# EAGLE design rtu04_half bridge (EAGLE 9.6.0)
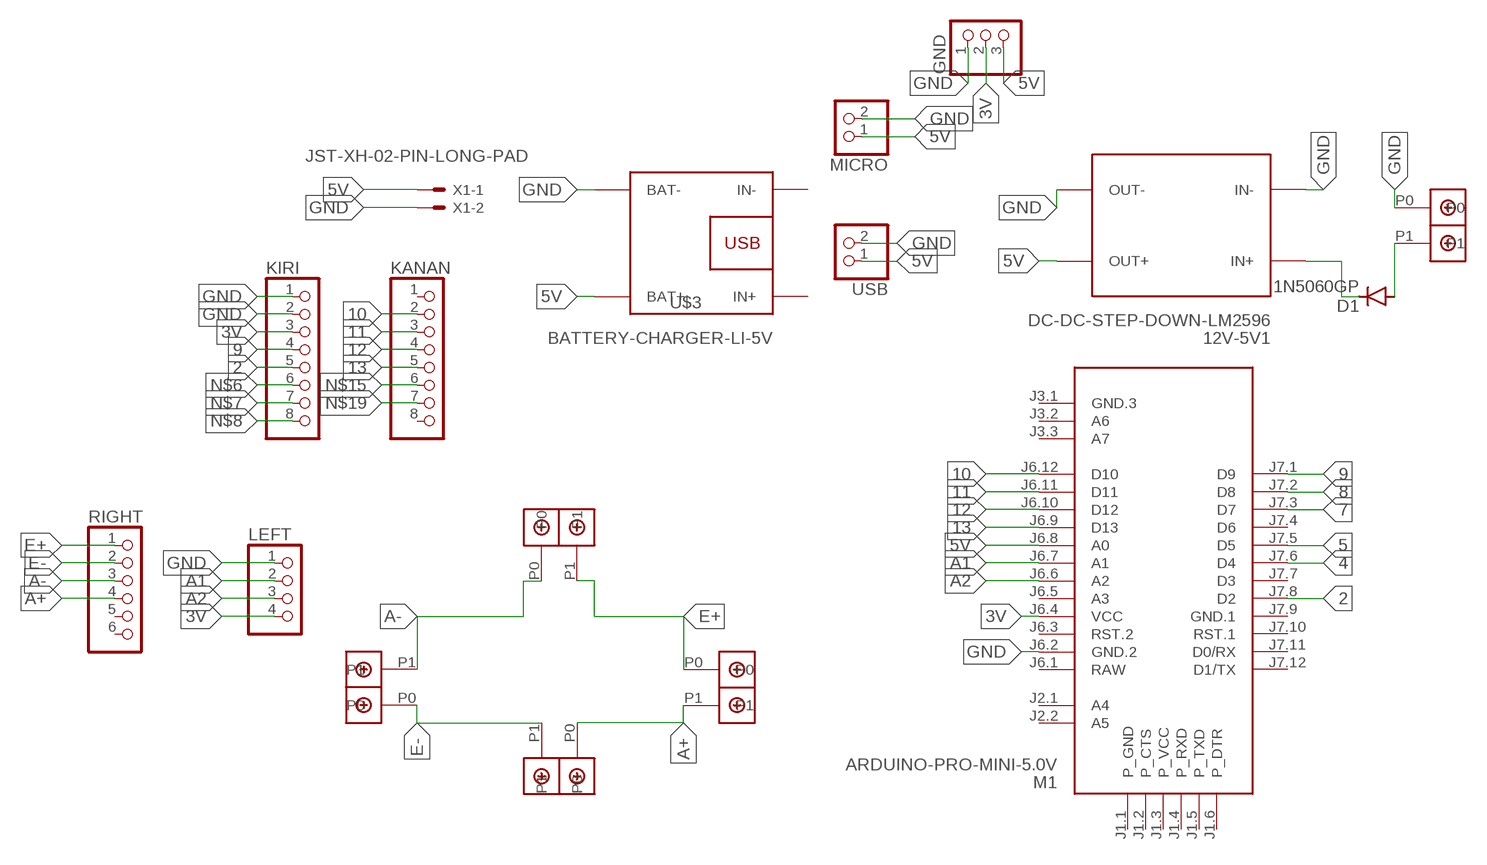
[diagram p0: schematic, sheet 1]

## Parts
12V-5V1  DC-DC-STEP-DOWN-LM2596  [DC-DC-STEP-DOWN-LM2596]
D1  1N5060GP  [DO15-12]
GND  PINHD-1X3  [1X03]
KANAN  PINHD-1X8  [1X08]
KIRI  PINHD-1X8  [1X08]
LEFT  PINHD-1X4  [1X04]
M1  ARDUINO-PRO-MINI-5.0V  [ARDUINO-PRO-MINI]
MICRO  PINHD-1X2  [1X02]
RIGHT  PINHD-1X6  [1X06]
U$1  DBCONN-1X2  [DBCONN-1X2]
U$2  DBCONN-1X2  [DBCONN-1X2]
U$3  BATTERY-CHARGER-LI-5V  [BATTERY-CHARGER-LI-5V]
U$4  DBCONN-1X2  [DBCONN-1X2]
U$5  DBCONN-1X2  [DBCONN-1X2]
U$6  DBCONN-1X2  [DBCONN-1X2]
USB  PINHD-1X2  [1X02]
X1  JST-XH-02-PIN-LONG-PAD  [JST-XH-02-PACKAGE-LONG-PAD]

## Nets
2: KIRI.5 M1.J7.8(D2)
3V: GND.2 KIRI.3 LEFT.4 M1.J6.4(VCC)
4: M1.J7.6(D4)
5: M1.J7.5(D5)
5V: 12V-5V1.OUT+ GND.3 M1.J6.8(A0) MICRO.1 U$3.BAT+ USB.1 X1.1
7: M1.J7.3(D7)
8: M1.J7.2(D8)
9: KIRI.4 M1.J7.1(D9)
10: KANAN.2 M1.J6.12(D10)
11: KANAN.3 M1.J6.11(D11)
12: KANAN.4 M1.J6.10(D12)
13: KANAN.5 M1.J6.9(D13)
A1: LEFT.2 M1.J6.7(A1)
A2: LEFT.3 M1.J6.6(A2)
A+: RIGHT.4 U$2.P0 U$4.P1
A-: RIGHT.3 U$5.P0 U$6.P1
E+: RIGHT.1 U$4.P0 U$5.P1
E-: RIGHT.2 U$2.P1 U$6.P0
GND: 12V-5V1.IN- 12V-5V1.OUT- GND.1 KIRI.1 KIRI.2 LEFT.1 M1.J6.2(GND.2) MICRO.2 U$1.P0 U$3.BAT- USB.2 X1.2
N$1: 12V-5V1.IN+ D1.C
N$2: D1.A U$1.P1
N$6: KIRI.6
N$7: KIRI.7
N$8: KIRI.8
N$15: KANAN.6
N$19: KANAN.7
Unconnected: KANAN.1 KANAN.8 M1.J1.1(P_GND) M1.J1.2(P_CTS) M1.J1.3(P_VCC) M1.J1.4(P_RXD) M1.J1.5(P_TXD) M1.J1.6(P_DTR) M1.J2.1(A4) M1.J2.2(A5) M1.J3.1(GND.3) M1.J3.2(A6) M1.J3.3(A7) M1.J6.3(RST.2) M1.J6.5(A3) M1.J7.4(D6) M1.J7.7(D3) M1.J7.10(RST.1) M1.J7.11(D0/RX) M1.J7.12(D1/TX) RIGHT.5 RIGHT.6 U$3.IN+ U$3.IN-

## Power pins joined to a net without a drawn wire
GND.1: M1.J7.9(GND.1)
RAW: M1.J6.1(RAW)

## Library data of the parts
12V-5V1 = diy-modules:DC-DC-STEP-DOWN-LM2596: DC/DC Step-Down Regulator based on LM2596-ADJ chip LM2596 datasheet available here: http://www.ti.com/lit/ds/symlink/lm2596.pdf Click here to find device on ebay.com <http://www.ebay.com/sch/lm2596+power+regulator>
D1 = diode:1N5060GP: DIODE controlled avalanche rectifier
GND = pinhead:PINHD-1X3: PIN HEADER
KANAN KIRI = pinhead:PINHD-1X8: PIN HEADER
LEFT = pinhead:PINHD-1X4: PIN HEADER
M1 = diy-modules:ARDUINO-PRO-MINI-*: Arduino Pro Mini and compatible devices More details available here: https://www.arduino.cc/en/Main/ArduinoBoardProMini Click here to find device on ebay.com <http://www.ebay.com/sch/arduino+pro+mini>
MICRO USB = pinhead:PINHD-1X2: PIN HEADER
RIGHT = pinhead:PINHD-1X6: PIN HEADER
U$1 U$2 U$4-U$6 = Terminal Block Connector:DBCONN-1X2
U$3 = diy-modules (1):BATTERY-CHARGER-LI-5V: Lithium Battery 5V Charger More details available here: http://www.buildcircuit.com/how-to-use-micro-usb-5v-1a-lithium-battery-charging-board-charger-module/ Click here to find device on ebay.com <http://www.ebay.com/sch/tp4056+charger+usb>
X1 = Rembrandt Electronics - JST XH Connectors v1-0:JST-XH-02-PIN: JST XH Connector 2 Pin Wire to board connector. Pitch: 2,54 mm, (0.100") Number of pins: 2 Created by Rembrandt Electronics www.rembrandtelectronics.com

## Board
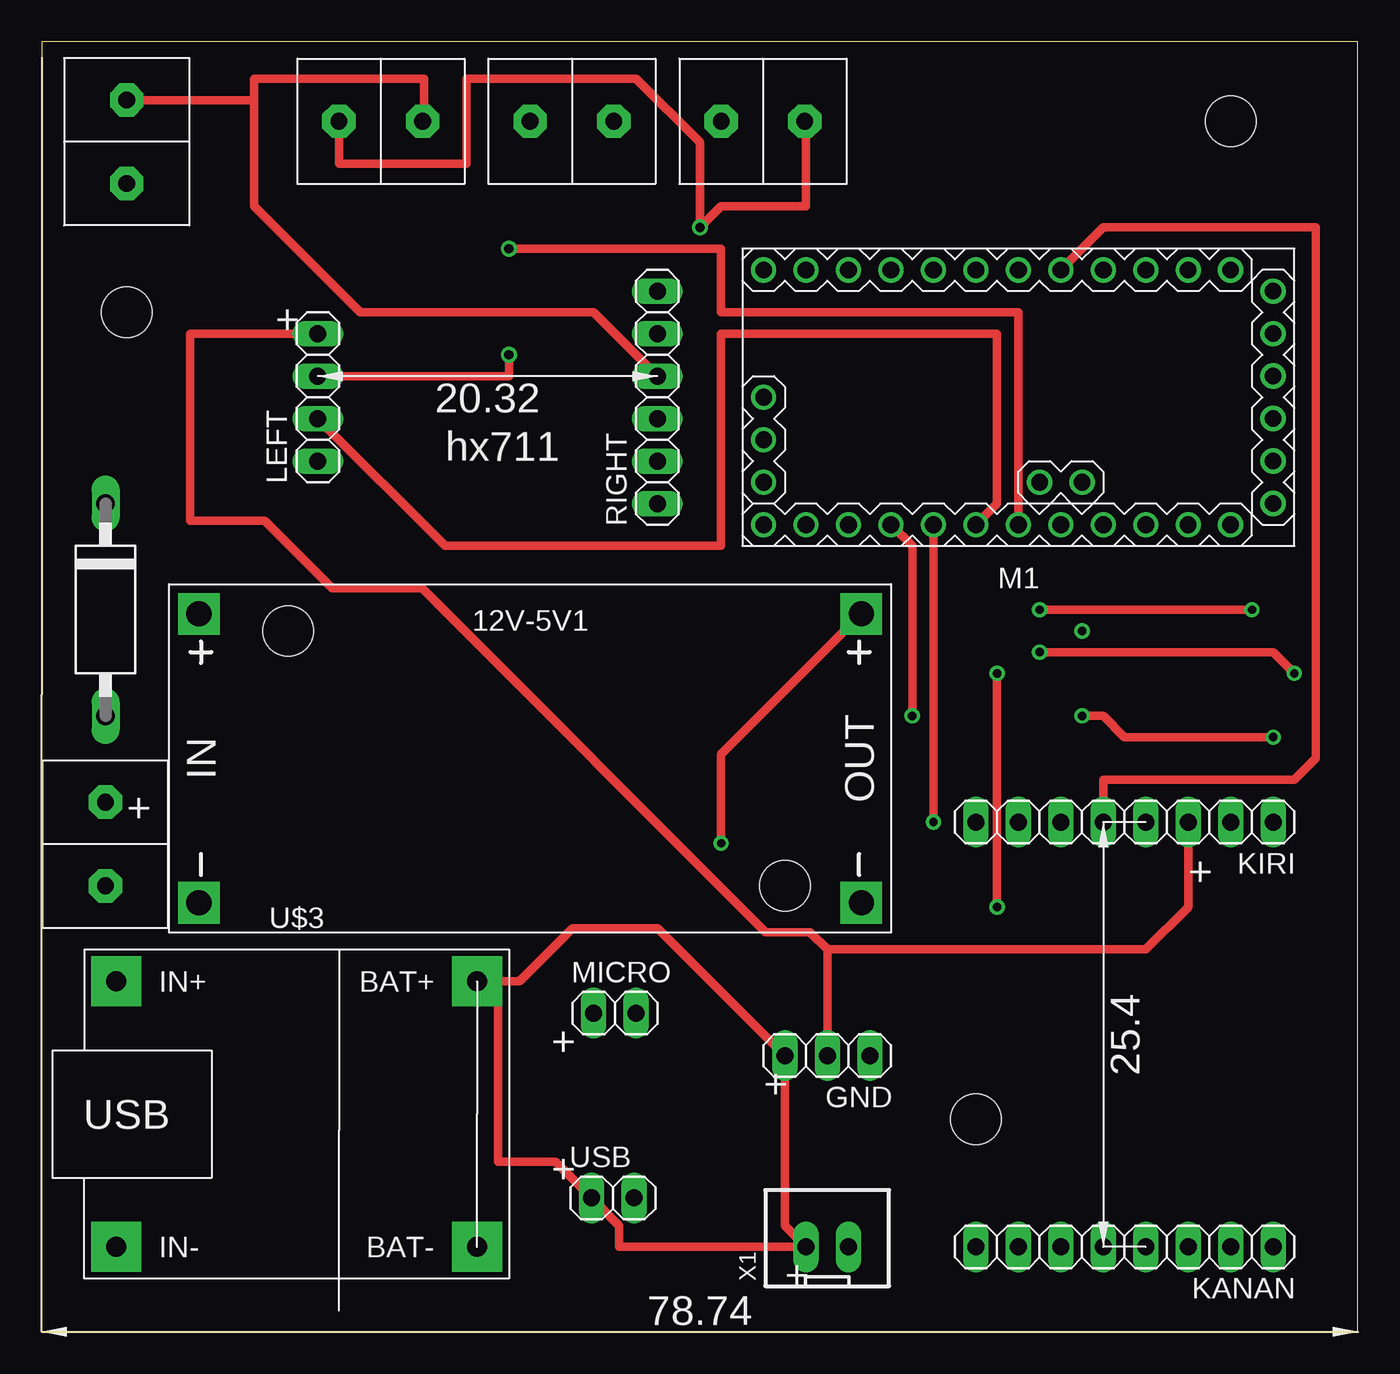
[diagram p1: board, top side]
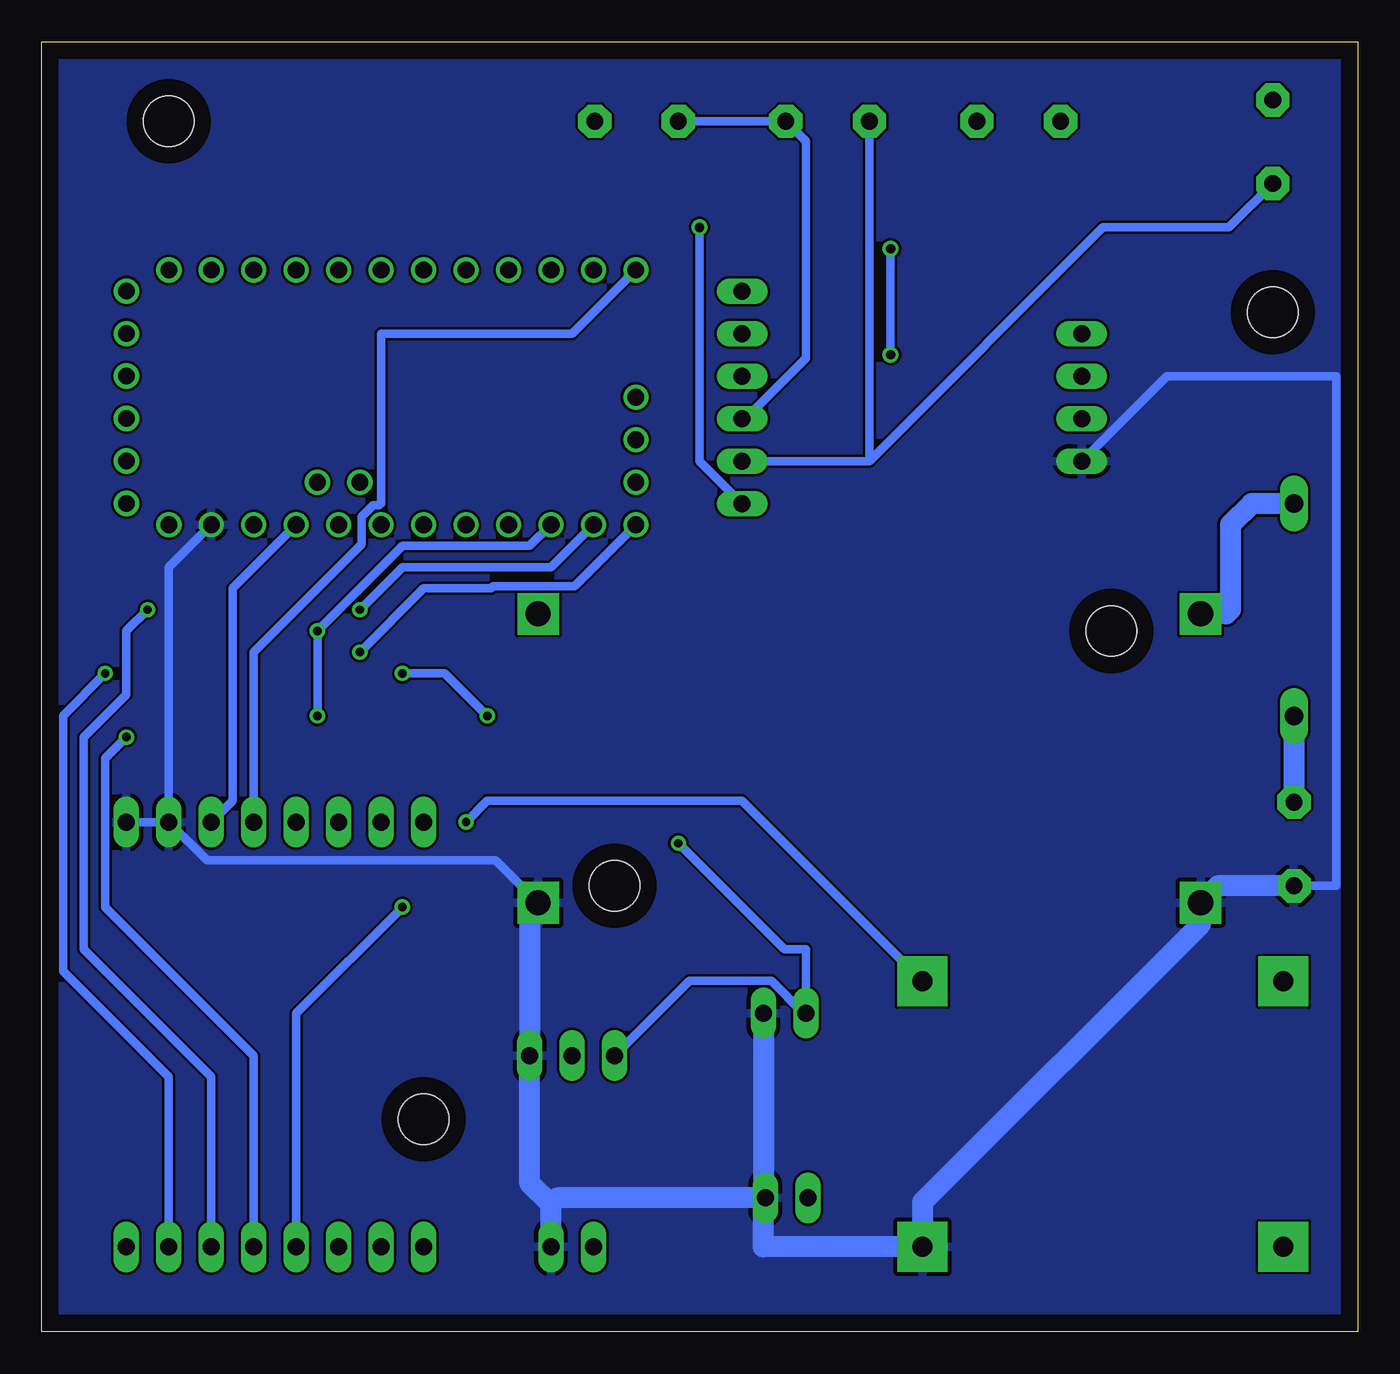
[diagram p2: board, bottom side, seen from below]

Size 78.72 x 77.14 mm. Coordinates in mm from the lower left corner, seen from the top.
Outline: 0,0 78.72,0 78.72,77.14 0,77.14 0,0
Copper layers (1*16): Top 0.035mm / dielectric 1.5mm / Bottom 0.035mm
Design rules "default": minimum track width 6mil, minimum drill 0.35mm, track to track 6mil, track to pad 6mil, pad to pad 6mil, via to via 6mil, smd to smd 6mil, copper to edge 40mil, drill to drill 6mil, minimum pad ring 10mil, minimum via ring 8mil, stop-mask expansion 4mil, vias tented up to drill 0mil, thermal gap 10mil
Holes 3 mm at 71.12,72.39 55.88,12.7 5.08,60.96

### Footprints (pad centres in the part's own frame; a part is rotated, then mirrored left to right if it is on the bottom)
DC-DC-STEP-DOWN-LM2596 = drill 1.5 pad 2.5 square: IN+ -19.812,8.636; IN- -19.812,-8.636; OUT+ 19.812,8.636; OUT- 19.812,-8.636 | hole 3: -14.478,7.62; 15.24,-7.62
DO15-12 = drill 1.118 long: A 6.35,0; C -6.35,0
1X03 = drill 1.016 long: 1 -2.54,0; 2 0,0; 3 2.54,0
1X08 = drill 1.016 long: 1 -8.89,0; 2 -6.35,0; 3 -3.81,0; 4 -1.27,0; 5 1.27,0; 6 3.81,0; 7 6.35,0; 8 8.89,0
1X04 = drill 1.016 long: 1 -3.81,0; 2 -1.27,0; 3 1.27,0; 4 3.81,0
ARDUINO-PRO-MINI = drill 1: J1.1 -15.24,6.35; J1.2 -15.24,3.81; J1.3 -15.24,1.27; J1.4 -15.24,-1.27; J1.5 -15.24,-3.81; J1.6 -15.24,-6.35; J2.1 -1.27,5.08; J2.2 -3.81,5.08; J3.1 15.24,0; J3.2 15.24,2.54; J3.3 15.24,5.08; J6.1 -12.7,7.62; J6.2 -10.16,7.62; J6.3 -7.62,7.62; J6.4 -5.08,7.62; J6.5 -2.54,7.62; J6.6 0,7.62; J6.7 2.54,7.62; J6.8 5.08,7.62; J6.9 7.62,7.62; J6.10 10.16,7.62; J6.11 12.7,7.62; J6.12 15.24,7.62; J7.1 15.24,-7.62; J7.2 12.7,-7.62; J7.3 10.16,-7.62; J7.4 7.62,-7.62; J7.5 5.08,-7.62; J7.6 2.54,-7.62; J7.7 0,-7.62; J7.8 -2.54,-7.62; J7.9 -5.08,-7.62; J7.10 -7.62,-7.62; J7.11 -10.16,-7.62; J7.12 -12.7,-7.62
1X02 = drill 1.016 long: 1 -1.27,0; 2 1.27,0
1X06 = drill 1.016 long: 1 -6.35,0; 2 -3.81,0; 3 -1.27,0; 4 1.27,0; 5 3.81,0; 6 6.35,0
DBCONN-1X2 = drill 1 pad 2 octagon: P0 -2.54,0; P1 2.46,0
BATTERY-CHARGER-LI-5V = drill 1.2 pad 3 square: BAT+ 10.795,8.255; BAT- 10.795,-7.62; IN+ -10.795,8.255; IN- -10.795,-7.62
JST-XH-02-PACKAGE-LONG-PAD = drill 1.016 long: 1 -1.27,0; 2 1.27,0

### Placement (x,y rotation side)
12V-5V1  29.21,34.29 0 top
D1  3.81,43.18 270 top
GND  46.99,16.51 180 top
KANAN  64.77,5.08 180 top
KIRI  64.77,30.48 180 top
LEFT  16.51,55.88 90 top
M1  58.42,55.88 180 top
MICRO  34.29,19.05 0 top
RIGHT  36.83,55.88 90 top
U$1  3.81,29.21 90 top
U$2  5.08,71.12 270 top
U$3  15.24,12.7 0 top
U$4  20.32,72.39 0 top
U$5  43.18,72.39 0 top
U$6  31.75,72.39 0 top
USB  34.16,8 0 top
X1  46.99,5.08 0 top

### Tracks (layer width: path | path; a pad name or v marks a point on that pad's centre or on a via)
2
  Top 0.508: M1.J7.8 63.5,66.04 76.2,66.04 76.2,34.29 74.93,33.02 63.5,33.02 KIRI.5
3V
  Top 0.508: GND.2 46.99,22.86 | 46.99,22.86 66.04,22.86 68.58,25.4 KIRI.3 | 46.99,22.86 45.95,23.9 43.3,23.9 22.75,44.45 17.38,44.45 13.34,48.49 8.89,48.49 8.89,59.69 LEFT.4
  Bottom 0.508: M1.J6.4 67.31,44.45 67.31,31.75 KIRI.3
5V  (via drill 0.5)
  Top 0.508: M1.J6.8 v53.34,30.48 | 12V-5V1.OUT+ 40.64,34.54 v40.64,29.21 | X1.1 44.45,6.35 GND.3 36.83,24.13 31.75,24.13 28.57,20.95 U$3.BAT+ 27.3,19.68 27.3,10.16 30.73,10.16 USB.1 34.54,6.35 34.54,5.08 X1.1
  Bottom 0.508: U$3.BAT+ 36.83,31.75 52.07,31.75 v53.34,30.48 | v40.64,29.21 34.29,22.86 33.02,22.86 MICRO.1 33.15,19.05 35.08,20.98 39.98,20.98 GND.3
9
  Bottom 0.508: M1.J7.1 46.99,59.69 58.42,59.69 58.42,49.53 58.53,49.42 58.9,49.42 59.58,48.74 59.58,47.1 66.04,40.64 KIRI.4
10  (via drill 0.5)
  Top 0.508: v59.69,40.64 73.66,40.64 v74.93,39.37
  Bottom 0.508: KANAN.2 71.12,15.24 77.45,21.57 77.45,36.85 v74.93,39.37 | M1.J6.12 46.86,44.58 51.71,44.58 51.84,44.45 55.88,44.45 v59.69,40.64
11  (via drill 0.5)
  Top 0.508: v59.69,43.18 v72.39,43.18
  Bottom 0.508: KANAN.3 68.58,15.24 76.2,22.86 76.2,35.56 73.66,38.1 73.66,41.91 v72.39,43.18 | M1.J6.11 48.26,45.72 57.15,45.72 v59.69,43.18
12  (via drill 0.5)
  Top 0.508: v73.66,35.56 64.77,35.56 63.5,36.83 v62.23,36.83
  Bottom 0.508: KANAN.4 66.04,16.51 74.93,25.4 74.93,34.29 v73.66,35.56 | M1.J6.10 49.53,46.99 57.15,46.99 v62.23,41.91 v62.23,36.83
13  (via drill 0.5)
  Top 0.508: v57.15,25.4 v57.15,39.37 | M1.J6.9 52.07,46.99 v52.07,36.83
  Bottom 0.508: v57.15,25.4 63.5,19.05 KANAN.5 | v57.15,39.37 54.61,39.37 v52.07,36.83
A1
  Top 0.508: M1.J6.7 57.15,49.53 57.15,59.69 40.64,59.69 40.64,46.99 24.13,46.99 LEFT.2
A2  (via drill 0.55)
  Top 0.508: M1.J6.6 58.42,60.96 40.64,60.96 40.64,64.77 v27.94,64.77 | v27.94,58.42 27.94,57.15 LEFT.3
  Bottom 0.508: v27.94,64.77 v27.94,58.42
A+
  Top 0.508: 12.7,73.66 12.7,74.93 22.86,74.93 22.86,72.39 U$4.P1 | 12.7,73.66 12.7,72.39 12.7,67.31 19.05,60.96 33.02,60.96 RIGHT.4 | U$2.P0 12.7,73.66
A-
  Bottom 0.508: RIGHT.3 36.63,54.61 33.02,58.22 33.02,71.2 U$6.P1 U$5.P0
E+  (via drill 0.55)
  Top 0.508: U$4.P0 17.78,69.85 25.4,69.85 25.4,74.93 35.56,74.93 39.37,71.12 v39.37,66.04 40.64,67.31 45.72,67.31 45.72,72.31 U$5.P1
  Bottom 0.508: RIGHT.1 39.37,52.07 v39.37,66.04
E-
  Bottom 0.508: 29.21,52.07 15.24,66.04 7.7,66.04 U$2.P1 | 29.21,52.07 RIGHT.2 | U$6.P0 29.21,52.07
GND
  Bottom 0.508: U$1.P0 1.27,26.67 1.27,57.15 5.08,57.15 6.55,57.15 11.43,57.15 LEFT.1 | KIRI.1 KIRI.2 | M1.J6.2 71.12,45.72 KIRI.2 | 12V-5V1.OUT- 51.56,28.19 68.83,28.19 KIRI.2
  Bottom 1.27: 35.56,7.87 35.56,5.08 U$3.BAT- 26.04,7.75 9.4,24.38 12V-5V1.IN- 8.38,26.67 U$1.P0 | 35.56,7.87 USB.2 47.88,8 48.26,7.62 | X1.2 48.26,7.62 | 48.26,7.62 49.53,8.89 GND.1 49.53,25.15 12V-5V1.OUT- | MICRO.2 35.56,7.87
  pour Bottom: 0,77.47 78.74,77.47 78.74,0 0,0
N$1
  Bottom 1.27: D1.C 6.35,49.53 7.62,48.26 7.62,43.18 7.87,42.93 12V-5V1.IN+
N$2
  Bottom 1.27: D1.A U$1.P1

### Text on the board
tPlace: + | hx711 | + | + | + | + | + | +